# Altium schematic sheet jlin_transceiver_prototype.SchDoc: Prototype Transceiver Board
size B; Engineer: Jonathan Lin; Revision: 1; SheetNumber: 1; SheetTotal: 3
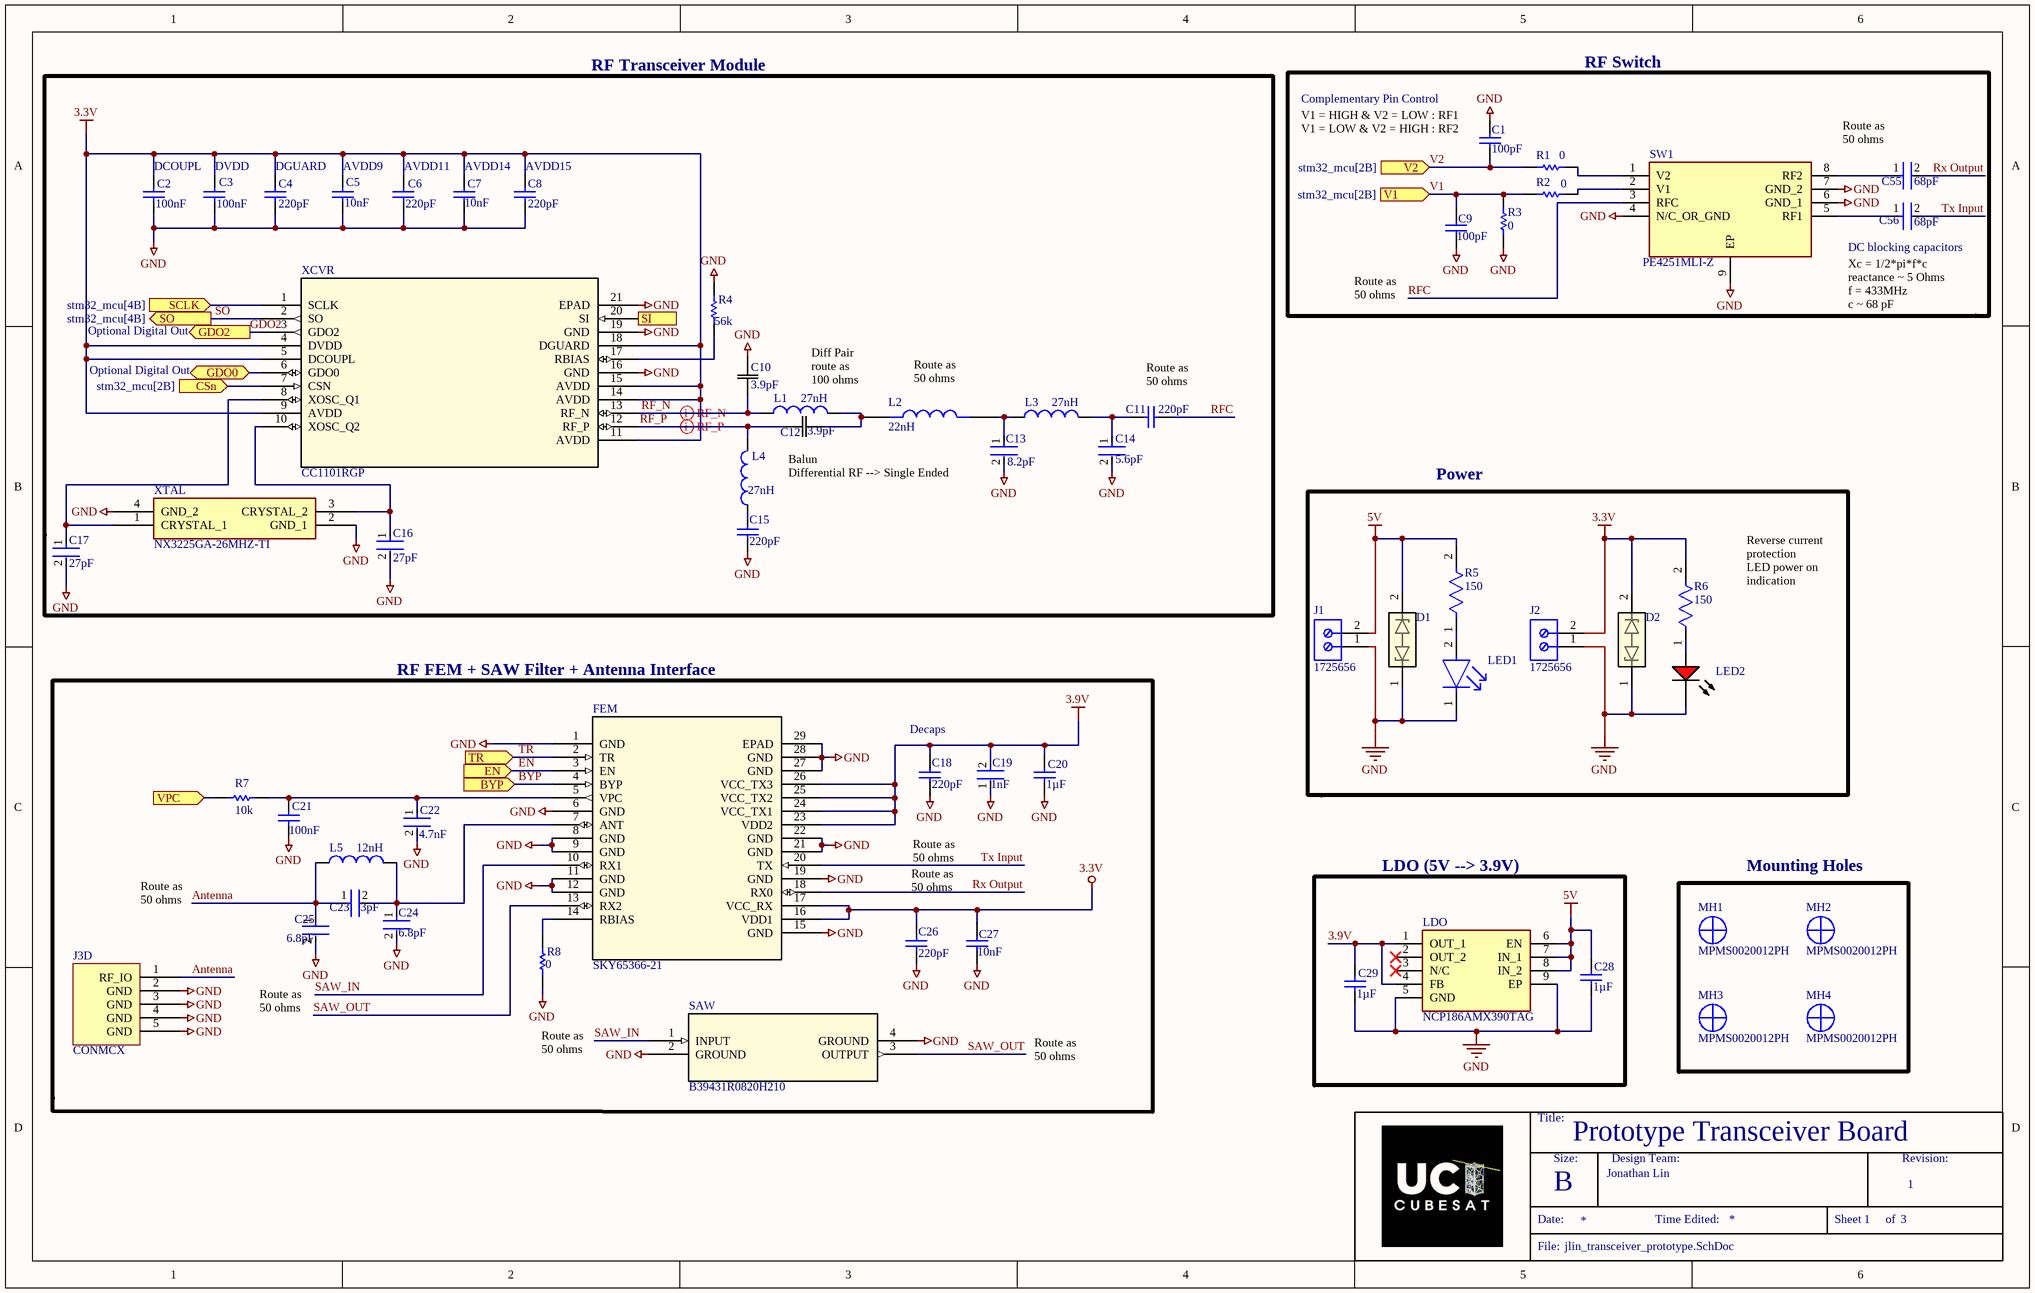
[diagram p0: jlin_transceiver_prototype.SchDoc]

## Parts
C1  value 100pF  [CAPC2013X70X45LL10T25]  (hidden comment: GRM2165C1H101JA01D)
C2  value 100nF  [CAPC2013X135X45ML10T25]  (hidden comment: GRM21BR72A104KAC4L)
C3  value 100nF  [CAPC2013X135X45ML10T25]  (hidden comment: GRM21BR72A104KAC4L)
C4  value 220pF  [CAPC2013X70X45LL10T25]  (hidden comment: GRM2165C1H221JA01D)
C5  value 10nF  [CAPC2013X135X45ML10T25]  (hidden comment: GRM21BR72A103KA01K)
C6  value 220pF  [CAPC2013X70X45LL10T25]  (hidden comment: GRM2165C1H221JA01D)
C7  value 10nF  [CAPC2013X135X45ML10T25]  (hidden comment: GRM21BR72A103KA01K)
C8  value 220pF  [CAPC2013X70X45LL10T25]  (hidden comment: GRM2165C1H221JA01D)
C9  value 100pF  [CAPC2013X70X45LL10T25]  (hidden comment: GRM2165C1H101JA01D)
C10  value 3.9pF  [CAP_CC0805_YAG]  (hidden comment: CC0805CRNPO9BN3R9)
C11  value 220pF  [CAPC2013X70X45LL10T25]  (hidden comment: GRM2165C1H221JA01D)
C12  value 3.9pF  [CAP_CC0805_YAG]  (hidden comment: CC0805CRNPO9BN3R9)
C13  value 8.2pF  [FP-0805-L_2_01_0_2-W_1_25-MFG]  (hidden comment: KGM21BCG2A8R2DT)
C14  value 5.6pF  [FP-C0805C-DN-IPC_A]  (hidden comment: C0805C569C5GACTU)
C15  value 220pF  [CAPC2013X70X45LL10T25]  (hidden comment: GRM2165C1H221JA01D)
C16  value 27pF  [FP-GRM21A-0_2-IPC_B]  (hidden comment: GRM21A5C2E270JW01D)
C17  value 27pF  [FP-GRM21A-0_2-IPC_B]  (hidden comment: GRM21A5C2E270JW01D)
C18  value 220pF  [CAPC2013X70X45LL10T25]  (hidden comment: GRM2165C1H221JA01D)
C19  value 1nF  [FP-GRM216-0_1-IPC_B]  (hidden comment: GRM2165C2A102JA01D)
C20  value 1µF  [CAPC2013X135X45LL10T25]  (hidden comment: GRM21BR71C105KA01L)
C21  value 100nF  [CAPC2013X135X45ML10T25]  (hidden comment: GRM21BR72A104KAC4L)
C22  value 4.7nF  [FP-GRM219-0_1-MFG]  (hidden comment: GRM2195C1H472JA01D)
C23  value 3pF  [FP-C0805C-DN-IPC_A]  (hidden comment: C0805C309C5GACTU)
C24  value 6.8pF  [FP-GQM219-0_15-MFG]  (hidden comment: GQM2195C2E6R8BB12D)
C25  value 6.8pF  [FP-GQM219-0_15-MFG]  (hidden comment: GQM2195C2E6R8BB12D)
C26  value 220pF  [CAPC2013X70X45LL10T25]  (hidden comment: GRM2165C1H221JA01D)
C27  value 10nF  [CAPC2013X135X45ML10T25]  (hidden comment: GRM21BR72A103KA01K)
C28  value 1µF  [CAPC2013X135X45LL10T25]  (hidden comment: GRM21BR71C105KA01L)
C29  value 1µF  [CAPC2013X135X45LL10T25]  (hidden comment: GRM21BR71C105KA01L)
C55  value 68pF  [FP-GRM21A-0_2-IPC_B]  (hidden comment: GRM21A5C2E680JW01D)
C56  value 68pF  [FP-GRM21A-0_2-IPC_B]  (hidden comment: GRM21A5C2E680JW01D)
D1  PESD3V3Z1BCSFYL  [SOD962-2_DSN0603-2_NEX]  (value not drawn)
D2  PESD3V3Z1BCSFYL  [SOD962-2_DSN0603-2_NEX]  (value not drawn)
FEM  SKY65366-21  [SKY65366-21-Footprint-1]
J1  1725656  [PHOE-1725656-2]
J2  1725656  [PHOE-1725656-2]
J3  CONMCX  [CONMCX002-Footprint-1]  (part D of 4)
L1  value 27nH  [WE-MK_0805_L2W1.25H0.85]  (hidden comment: 7447880127)
L2  value 22nH  [INDC2012X105N]  (hidden comment: AIMC-0805-22NJ-T)
L3  value 27nH  [WE-MK_0805_L2W1.25H0.85]  (hidden comment: 7447880127)
L4  value 27nH  [WE-MK_0805_L2W1.25H0.85]  (hidden comment: 7447880127)
L5  value 12nH  [AIMC-0805_ABR]  (hidden comment: AIMC-0805-12NJ-T)
LDO  NCP186AMX390TAG  [NCP186AMX330TAG]
LED1  LTST-C170KFKT  [FP-LTST-C170KFKT-MFG]  (value not drawn)
LED2  LTST-C190KRKT  [LTST-C191KRKT_V]  (value not drawn)
MH1  MPMS0020012PH  [BF-MPMS0020012PH]
MH2  MPMS0020012PH  [BF-MPMS0020012PH]
MH3  MPMS0020012PH  [BF-MPMS0020012PH]
MH4  MPMS0020012PH  [BF-MPMS0020012PH]
R1  value 0  [RESC2013X60X35ML10T20]  (hidden comment: Resistor 0R +/- 5% 0805 125 mW)
R2  value 0  [RESC2013X60X35ML10T20]  (hidden comment: Resistor 0R +/- 5% 0805 125 mW)
R3  value 0  [RESC2013X60X35ML10T20]  (hidden comment: Resistor 0R +/- 5% 0805 125 mW)
R4  value 56k  [RESC2013X70X40NL20T20]  (hidden comment: ERJ-6GEYJ563V)
R5  value 150  [FP-CRCW1210-e3-IPC_C]  (hidden comment: CRCW1210150RJNEA)
R6  value 150  [FP-CRCW1210-e3-IPC_C]  (hidden comment: CRCW1210150RJNEA)
R7  value 10k  [RESC2013X60X35LL10T20]  (hidden comment: RC0805FR-0710KL)
R8  value 0  [RESC2013X60X35ML10T20]  (hidden comment: Resistor 0R +/- 5% 0805 125 mW)
SAW  B39431R0820H210  [B39431R0820H210_QUA]
SW1  PE4251MLI-Z  [SOP65P490X106-9N]
XCVR  CC1101RGP  [CC1101RGP-Footprint-1]
XTAL  NX3225GA-26MHZ-TI  [NX3225GA_NDK]

## Blocks framed on the sheet
RF Transceiver Module: C2-C8 C10-C17 L1-L4 R4 XCVR XTAL
RF Switch: C1 C9 C55 C56 R1-R3 SW1
Power: D1 D2 J1 J2 LED1 LED2 R5 R6
RF FEM + SAW Filter + Antenna Interface: C18-C27 FEM J3 L5 R7 R8 SAW
LDO (5V --> 3.9V): C28 C29 LDO
Mounting Holes: MH1-MH4

## Ports
BYP (in, see stm32_mcu[6A]), CSn (in, see stm32_mcu[2B]), EN (in, see stm32_mcu[6A]), GDO0 (bidir, see stm32_mcu[2B]), GDO2 (out, see stm32_mcu[2B]), SCLK (in, see stm32_mcu[4B]), SI (in, see stm32_mcu[4B]), SO (out, see stm32_mcu[4B]), TR (in, see stm32_mcu[6A]), V1 (in, see stm32_mcu[2B]), V2 (in, see stm32_mcu[2B]), VPC (in, see stm32_mcu[6A])

## Nets
3.3V: C2.2 C3.2 C4.2 C5.2 C6.2 C7.2 C8.2 C26.2 C27.2 D2.2 FEM.16(VDD1) FEM.17(VCC_RX) J2.2 R6.2 XCVR.4(DVDD) XCVR.5(DCOUPL) XCVR.9(AVDD) XCVR.11(AVDD) XCVR.14(AVDD) XCVR.15(AVDD) XCVR.18(DGUARD)
3.9V: C18.2 C19.2 C20.2 C29.2 FEM.23(VDD2) FEM.24(VCC_TX1) FEM.25(VCC_TX2) FEM.26(VCC_TX3) LDO.1(OUT_1) LDO.4(FB)
5V: C28.2 D1.2 J1.2 LDO.6(EN) LDO.7(IN_1) LDO.8(IN_2) R5.2
GND: C1.2 C2.1 C3.1 C4.1 C5.1 C6.1 C7.1 C8.1 C9.1 C10.2 C13.2 C14.2 C15.1 C16.2 C17.2 C18.1 C19.1 C20.1 C21.1 C22.2 C24.2 C25.2 C26.1 C27.1 C28.1 C29.1 D1.1 D2.1 FEM.1(GND) FEM.6(GND) FEM.8(GND) FEM.9(GND) FEM.11(GND) FEM.12(GND) FEM.15(GND) FEM.19(GND) FEM.21(GND) FEM.22(GND) FEM.27(GND) FEM.28(GND) FEM.29(EPAD) J1.1 J2.1 J3.2(GND) J3.3(GND) J3.4(GND) J3.5(GND) LDO.5(GND) LDO.9(EP) LED1.1(C) LED2.2(K) R3.1 R4.2 R8.1 SAW.2(GROUND) SAW.4(GROUND) SW1.4(N/C_OR_GND) SW1.6(GND_1) SW1.7(GND_2) SW1.9(EP) XCVR.16(GND) XCVR.19(GND) XCVR.21(EPAD) XTAL.2(GND_1) XTAL.4(GND_2)
Antenna: C23.1 C25.1 J3.1(RF_IO) L5.1
BYP: FEM.4(BYP) ; port BYP
CSn: XCVR.7(CSN) ; port CSn
EN: FEM.3(EN) ; port EN
GDO0: XCVR.6(GDO0) ; port GDO0
GDO2: XCVR.3(GDO2) ; port GDO2
RF_N: C10.1 L1.1 XCVR.13(RF_N)
RF_P: C12.1 L4.2 XCVR.12(RF_P)
RFC: C11.2 SW1.3(RFC)
Rx Output: C55.2 FEM.18(RX0)
SAW_IN: FEM.10(RX1) SAW.1(INPUT)
SAW_OUT: FEM.13(RX2) SAW.3(OUTPUT)
SCLK: XCVR.1(SCLK) ; port SCLK
SI: XCVR.20(SI) ; port SI
SO: XCVR.2(SO) ; port SO
TR: FEM.2(TR) ; port TR
Tx Input: C56.2 FEM.20(TX)
V1: C9.2 R2.1 R3.2 ; port V1
V2: C1.1 R1.1 ; port V2
VPC: R7.1 ; port VPC
NetC11_1: C11.1 C14.1 L3.2
NetC12_2: C12.2 L1.2 L2.1
NetC13_1: C13.1 L2.2 L3.1
NetC15_2: C15.2 L4.1
NetC16_1: C16.1 XCVR.10(XOSC_Q2) XTAL.3(CRYSTAL_2)
NetC17_1: C17.1 XCVR.8(XOSC_Q1) XTAL.1(CRYSTAL_1)
NetC21_2: C21.2 C22.1 FEM.5(VPC) R7.2
NetC23_2: C23.2 C24.1 FEM.7(ANT) L5.2
NetC55_1: C55.1 SW1.8(RF2)
NetC56_1: C56.1 SW1.5(RF1)
NetFEM_14: FEM.14(RBIAS) R8.2
NetLED1_2: LED1.2(A) R5.1
NetLED2_1: LED2.1(A) R6.1
NetR1_2: R1.2 SW1.1(V2)
NetR2_2: R2.2 SW1.2(V1)
NetR4_1: R4.1 XCVR.17(RBIAS)

Not connected (* = marked no-connect by the designer): LDO 2(OUT_2)* 3(N/C)*; MH1 1; MH2 1; MH3 1; MH4 1

## Layout directives
differential pair: RF_N, RF_P

## Notes on the sheet
- (near C1) Complementary Pin Control
- (near C1) V1 = HIGH & V2 = LOW : RF1
  V1 = LOW & V2 = HIGH : RF2
- Route as
  50 ohms
- (near C2) DCOUPL
- (near C3) DVDD
- (near C4) DGUARD
- (near C5) AVDD9
- (near C6) AVDD11
- (near C7) AVDD14
- (near C8) AVDD15
- DC blocking capacitors
- Optional Digital Out
- Xc = 1/2*pi*f*c
  reactance ~ 5 Ohms
  f = 433MHz
  c ~ 68 pF
- Diff Pair
  route as
  100 ohms
- (near L2) Route as
  50 ohms
- (near C11) Route as
  50 ohms
- Balun
  Differential RF --> Single Ended
- Reverse current protection
  LED power on indication
- (near C18) Decaps
- (near C25) Route as
  50 ohms
- (near R8) Route as
  50 ohms
- Title:
- Size:
- Design Team:
- Revision:
- Date:
- B
- Time Edited:
- Sheet
- of
- File:

## Library data of the parts
C1 C9 = CMP-001-00139-1: Ceramic Capacitor, Multilayer, Ceramic, 50V, 5% +Tol, 5% -Tol, C0G, -/+30ppm/Cel TC, 0.0001uF, Surface Mount, 0805; Multilayer: Yes; Max Operating Temperature: 125°C; Height: 0.6mm; Packaging: Tape and Reel; Temperature Characteristics Code: C0G; Reach SVHC Compliant: Yes; Tolerance (fill in as +-): 5%; Width: 1.25mm; Terminal Finish: Nickel; Tolerance  (fill in as +-): 5%; Package Shape: Rectangular; Termination: Wraparound; Mounting Technology: Surface Mount; Length: 2mm; Package Style: SMTMeter; Dielectric Material: Ceramic; Min Operating Temperature: -55°C; Case/Package: 0805; JESD-609 Code: e3; Capacitor Type: Ceramic; RoHS Compliant: Yes; Rated DC Voltage (URdc): 50V; Pins: 2
C2 C3 C21 = CMP-001-00124-1: Ceramic Capacitor, Multilayer, Ceramic, 100V, 10% +Tol, 10% -Tol, X7R, 15% TC, 0.1uF, Surface Mount, 0805; Multilayer: Yes; Capacitor Type: Ceramic; Width: 1.25mm; Tolerance (fill in as +-): 10%; Max Operating Temperature: 125°C; Package Style: SMTMeter; Termination: Wraparound; Packaging: Tape and Reel; Rated DC Voltage (URdc): 100V; Length: 2mm; Terminal Finish: Nickel; Min Operating Temperature: -55°C; Reach SVHC Compliant: Yes; JESD-609 Code: e3; RoHS Compliant: Yes; Tolerance  (fill in as +-): 10%; Temperature Characteristics Code: X7R; Pins: 2; Dielectric Material: Ceramic; Case/Package: 0805; Package Shape: Rectangular; Mounting Technology: Surface Mount; Height: 1.25mm
C4 C6 C8 C11 C15 C18 C26 = CMP-001-00130-1: Ceramic Capacitor, Multilayer, Ceramic, 50V, 5% +Tol, 5% -Tol, C0G, -/+30ppm/Cel TC, 0.00022uF, Surface Mount, 0805; Multilayer: Yes; Reach SVHC Compliant: Yes; Capacitor Type: Ceramic; Pins: 2; Height: 0.6mm; Length: 2mm; Tolerance (fill in as +-): 5%; Min Operating Temperature: -55°C; Package Shape: Rectangular; Case/Package: 0805; Package Style: SMTMeter; Width: 1.25mm; JESD-609 Code: e3; Tolerance  (fill in as +-): 5%; Packaging: Tape and Reel; Termination: Wraparound; Mounting Technology: Surface Mount; Temperature Characteristics Code: C0G; Max Operating Temperature: 125°C; Dielectric Material: Ceramic; Rated DC Voltage (URdc): 50V; Terminal Finish: Nickel; RoHS Compliant: Yes
  C4 C6 C8: ComponentLink1Description: New link; ComponentLink1URL: *
C5 C7 C27 = CMP-001-00132-1: Ceramic Capacitor, Multilayer, Ceramic, 100V, 10% +Tol, 10% -Tol, X7R, 15% TC, 0.01uF, Surface Mount, 0805; Multilayer: Yes; Case/Package: 0805; Tolerance  (fill in as +-): 10%; JESD-609 Code: e3; Width: 1.25mm; Termination: Wraparound; Pins: 2; Tolerance (fill in as +-): 10%; Dielectric Material: Ceramic; RoHS Compliant: Yes; Capacitor Type: Ceramic; Packaging: Tape and Reel; Rated DC Voltage (URdc): 100V; Length: 2mm; Temperature Characteristics Code: X7R; Terminal Finish: Nickel; Min Operating Temperature: -55°C; Package Style: SMTMeter; Max Operating Temperature: 125°C; Reach SVHC Compliant: Yes; Height: 1.25mm; Mounting Technology: Surface Mount; Package Shape: Rectangular
  C5 C7: ComponentLink1Description: New link; ComponentLink1URL: *
C10 C12 = CMP-001-00101-5: 3.9 pF ±0.25pF 50V Ceramic Capacitor C0G, NP0 0805 (2012 Metric); Mfr_Name: Yageo; RoHS Compliant: Yes; Component Type: Standard; Max Operating Temperature: 125°C; Source: CC0805CRNPO9BN3R9.SchLib; Min Operating Temperature: -55°C; Pins: 2; Capacitor Type: Ceramic; Design Item ID: CC0805CRNPO9BN3R9; Case/Package: 0805; Mounting Technology: Surface Mount
C13 = CMP-001-00135-2: Cap Cer 8.2PF 100V C0G/NP0 0805; Temperature Characteristics Code: C0G; Tolerance (fill in as +-): 6.0976%; Dielectric Material: Ceramic; Multilayer: Yes; Case/Package: 0805; Reach SVHC Compliant: Yes; RoHS Compliant: Yes; JESD-609 Code: e3; Width: 1.25mm; Min Operating Temperature: -55°C; Terminal Finish: Nickel; Mounting Technology: Surface Mount; Rated DC Voltage (URdc): 100V; Termination: Wraparound; Height: 0.94mm; Package Style: SMTMeter; Length: 2.01mm; Pins: 2; Package Shape: Rectangular; Packaging: Tape and Reel; Tolerance  (fill in as +-): 6.0976%; Capacitor Type: Ceramic; Max Operating Temperature: 125°C
C14 = CMP-001-00134-1: Ceramic Capacitor, Multilayer, Ceramic, 50V, 4.46% +Tol, 4.46% -Tol, C0G, 30ppm/Cel TC, 0.0000056uF, Surface Mount, 0805; Tolerance (fill in as +-): 4.4643%; Multilayer: Yes; Capacitor Type: Ceramic; Temperature Characteristics Code: C0G; Packaging: Tape and Reel; Length: 2mm; JESD-609 Code: e3; Dielectric Material: Ceramic; Terminal Finish: Nickel; Tolerance  (fill in as +-): 4.4643%; Rated DC Voltage (URdc): 50V; Pins: 2; Mounting Technology: Surface Mount; Case/Package: 0805; Reach SVHC Compliant: Yes; Package Shape: Rectangular; RoHS Compliant: Yes; Max Operating Temperature: 125°C; Width: 1.25mm; Package Style: SMTMeter; Min Operating Temperature: -55°C; Termination: Wraparound; Height: 0.78mm
C16 C17 = CMP-001-00133-1: Ceramic Capacitor, Multilayer, Ceramic, 250V, 5% +Tol, 5% -Tol, C0G, 30ppm/Cel TC, 0.000027uF, Surface Mount, 0805; Multilayer: Yes; Max Operating Temperature: 125°C; Width: 1.25mm; Mounting Technology: Surface Mount; Length: 2mm; Package Style: SMTMeter; RoHS Compliant: Yes; Tolerance  (fill in as +-): 5%; Termination: Wraparound; Dielectric Material: Ceramic; Packaging: Tape and Reel; Reach SVHC Compliant: Yes; Tolerance (fill in as +-): 5%; Temperature Characteristics Code: C0G; Capacitor Type: Ceramic; Case/Package: 0805; Height: 1mm; Pins: 2; Min Operating Temperature: -55°C; JESD-609 Code: e3; Terminal Finish: Nickel; Rated DC Voltage (URdc): 250V; Package Shape: Rectangular
C19 = CMP-001-00136-1: Ceramic Capacitor, Multilayer, Ceramic, 100V, 5% +Tol, 5% -Tol, C0G, 30ppm/Cel TC, 0.001uF, Surface Mount, 0805; Multilayer: Yes; Package Style: SMTMeter; Capacitor Type: Ceramic; Tolerance (fill in as +-): 5%; Termination: Wraparound; Min Operating Temperature: -55°C; Package Shape: Rectangular; JESD-609 Code: e3; Max Operating Temperature: 125°C; Width: 1.25mm; Packaging: Tape and Reel; Dielectric Material: Ceramic; Mounting Technology: Surface Mount; Terminal Finish: Nickel; Rated DC Voltage (URdc): 100V; Length: 2mm; Pins: 2; Reach SVHC Compliant: Yes; Case/Package: 0805; RoHS Compliant: Yes; Tolerance  (fill in as +-): 5%; Height: 0.6mm; Temperature Characteristics Code: C0G
C20 C28 C29 = CMP-001-00129-1: Ceramic Capacitor, Multilayer, Ceramic, 16V, 10% +Tol, 10% -Tol, X7R, 15% TC, 1uF, Surface Mount, 0805; Multilayer: Yes; Length: 2mm; Terminal Finish: Nickel; RoHS Compliant: Yes; Packaging: Tape and Reel; Termination: Wraparound; Reach SVHC Compliant: Yes; Rated DC Voltage (URdc): 16V; Max Operating Temperature: 125°C; Dielectric Material: Ceramic; Tolerance (fill in as +-): 10%; Min Operating Temperature: -55°C; Package Style: SMTMeter; Case/Package: 0805; Height: 1.25mm; Temperature Characteristics Code: X7R; Capacitor Type: Ceramic; Mounting Technology: Surface Mount; Package Shape: Rectangular; Tolerance  (fill in as +-): 10%; JESD-609 Code: e3; Width: 1.25mm; Pins: 2
C22 = CMP-001-00138-1: Ceramic Capacitor, Multilayer, Ceramic, 50V, 5% +Tol, 5% -Tol, C0G, 30ppm/Cel TC, 0.0047uF, Surface Mount, 0805; Multilayer: Yes; Min Operating Temperature: -55°C; Mounting Technology: Surface Mount; Height: 0.85mm; Width: 1.25mm; Length: 2mm; RoHS Compliant: Yes; Termination: Wraparound; Pins: 2; Max Operating Temperature: 125°C; Tolerance  (fill in as +-): 5%; Package Style: SMTMeter; Package Shape: Rectangular; Reach SVHC Compliant: Yes; Capacitor Type: Ceramic; Tolerance (fill in as +-): 5%; Terminal Finish: Nickel; Temperature Characteristics Code: C0G; JESD-609 Code: e3; Case/Package: 0805; Dielectric Material: Ceramic; Rated DC Voltage (URdc): 50V; Packaging: Tape and Reel
C23 = CMP-001-00142-2: Ceramic Capacitor, Multilayer, Ceramic, 50V, 8.33% +Tol, 8.33% -Tol, C0G, 30ppm/Cel TC, 0.000003uF, Surface Mount, 0805; Multilayer: Yes; Tolerance (fill in as +-): 8.3333%; Max Operating Temperature: 125°C; Reach SVHC Compliant: Yes; Rated DC Voltage (URdc): 50V; RoHS Compliant: Yes; Package Style: SMTMeter; Pins: 2; Dielectric Material: Ceramic; Height: 0.78mm; Min Operating Temperature: -55°C; Termination: Wraparound; Width: 1.25mm; Packaging: Tape and Reel; Length: 2mm; Capacitor Type: Ceramic; Terminal Finish: Nickel; Temperature Characteristics Code: C0G; Case/Package: 0805; Package Shape: Rectangular; Tolerance  (fill in as +-): 8.3333%; JESD-609 Code: e3; Mounting Technology: Surface Mount
C24 C25 = CMP-001-00143-1: Ceramic Capacitor, Multilayer, Ceramic, 250V, 1.47% +Tol, 1.47% -Tol, C0G, -/+30ppm/Cel TC, 0.0000068uF, Surface Mount, 0805; Multilayer: Yes; RoHS Compliant: Yes; Temperature Characteristics Code: C0G; Case/Package: 0805; Capacitor Type: Ceramic; Max Operating Temperature: 125°C; Dielectric Material: Ceramic; Packaging: Tape and Reel; Terminal Finish: Nickel; Tolerance  (fill in as +-): 1.47%; Termination: Wraparound; JESD-609 Code: e3; Package Shape: Rectangular; Reach SVHC Compliant: Yes; Mounting Technology: Surface Mount; Min Operating Temperature: -55°C; Rated DC Voltage (URdc): 250V; Pins: 2; Tolerance (fill in as +-): 1.47%
C55 C56 = CMP-001-00140-1: Ceramic Capacitor, Multilayer, Ceramic, 250V, 5% +Tol, 5% -Tol, C0G, 30ppm/Cel TC, 0.000068uF, Surface Mount, 0805; Multilayer: Yes; Package Shape: Rectangular; Temperature Characteristics Code: C0G; Package Style: SMTMeter; Length: 2mm; Min Operating Temperature: -55°C; Width: 1.25mm; Tolerance  (fill in as +-): 5%; Case/Package: 0805; Dielectric Material: Ceramic; Packaging: Tape and Reel; Termination: Wraparound; RoHS Compliant: Yes; Mounting Technology: Surface Mount; Tolerance (fill in as +-): 5%; Height: 1mm; Capacitor Type: Ceramic; Reach SVHC Compliant: Yes; Pins: 2; JESD-609 Code: e3; Max Operating Temperature: 125°C; Rated DC Voltage (URdc): 250V; Terminal Finish: Nickel
D1 D2 = CMP-004-00036-2: PESD3V3Zxx: 6.8 V 15 A 0.45 pF Bidirectional ESD Protection Diode - DSN0603-2
FEM = CMP-00025-00009-1: RF and Baseband Circuit; RoHS Compliant: Yes
J1 J2 = CMP-2000-05299-1: Male Header, Pitch 2.54 mm, 1 x 2 Position, Height 9 mm, Tail Length 3.5 mm; Manufacturer: Phoenix Contact; Number of contacts: 2; Content: 250pc(s); Pitch: 2.54mm; Industrial packaging: Yes; System: Connector; Colour: Green; Manufacturer part No.: 1725656; Type: MPT0,5/2-2,54; Datasheet URL: http://datasheet.octopart.com/1725656-Phoenix-Contact-datasheet-5302866.pdf; Manufacturer URL: http://www.phoenixcontact.com/; Datasheet Version: Apr-08
J3 = CMP-00025-00005-4: MCX Connector Right Angle Jack (Female), PCB Through-Hole Mount, Gold
L1 L3 L4 = CMP-006-00032-1: Multilayer Inductor, 27Nh, 0.3A, 0805 Rohs Compliant: Yes
L2 = CMP-006-00036-2: General Purpose Inductor, 0.022uH, 5%, 1 Element, Ceramic-Core, SMD, 0805; Case/Size Code: 0805; Shielding: Unshielded; Test Frequency: 15MHz; Quality Factor-Min (at L-nom): 100; MF: Abracon; DC Resistance (DCR): 500mR; Inductor Application: RF INDUCTOR; Self Resonant Frequency: 1.4GHz; Shape/Size Description: RECTANGULAR PACKAGE; Max Current Rating: 300mA; Channels: 1; Reach SVHC Compliant: Yes; Termination: Wraparound; Manufacturer Series: AIMC-0805; Design Item ID: AIMC-0805-22NJ-T; Source: AIMC-0805-22NJ-T.SchLib; Pins: 2; Check_prices: https://www.snapeda.com/parts/AIMC-0805-22NJ-T/Abracon/view-part/?ref=eda; Min Operating Temperature: -55°C; Case/Package: 0805 Abracon; Surface Mount: Yes; Component Type: Standard; Inductance-Nom (L): 0.022uH; Inductor Type: GENERAL PURPOSE INDUCTOR; Max Operating Temperature: 125°C; Core Material: Ceramic; RoHS Compliant: Yes; MP: AIMC-0805-22NJ-T; SnapEDA_Link: https://www.snapeda.com/parts/AIMC-0805-22NJ-T/Abracon/view-part/?ref=snap; Tolerance: 5%; Terminal Placement: Dual Ended
L5 = CMP-006-00034-1: General Purpose Inductor, 0.012uH, 5%, 1 Element, Ceramic-Core, SMD, 0805; DC Resistance (DCR): 350mR; Test Frequency: 15MHz; Channels: 1; Shielding: Unshielded; Self Resonant Frequency: 1.9GHz; Quality Factor-Min (at L-nom): 100; Inductor Application: RF INDUCTOR; Shape/Size Description: RECTANGULAR PACKAGE; Case/Size Code: 0805; Max Current Rating: 300mA; Inductance-Nom (L): 0.012uH; Termination: Wraparound; Terminal Placement: Dual Ended; Core Material: Ceramic; Max Operating Temperature: 125°C; Pins: 2; Reach SVHC Compliant: Yes; Min Operating Temperature: -55°C; RoHS Compliant: Yes; Manufacturer Series: AIMC-0805; Surface Mount: Yes; Tolerance: 5%; Inductor Type: GENERAL PURPOSE INDUCTOR
LDO = CMP-031-00016-2: Fixed Positive LDO Regulator, 3.9V, 0.13V Dropout, CMOS, PDSO8; Manufacturer_Name: onsemi; Max Supply Voltage: 5.5V; Regulator Type: FIXED POSITIVE SINGLE OUTPUT LDO REGULATOR; Min Input Voltage: 4.4V; Output Current1-Max: 1A; Output Voltage1-Min: 3.822V; Package Body Material: Plastic; Channels: 1; Dropout Voltage1-Max: 130mV; Output Voltage1-Max: 3.939V; Source: SamacSys.SchLib; Design Item ID: NCP186AMX390TAG; Mouser Price/Stock: https://www.mouser.co.uk/ProductDetail/onsemi/NCP186AMX390TAG?qs=tCMd4XlZ%2FiBm0g5PCqviEQ%3D%3D; Mouser Part Number: 863-NCP186AMX390TAG; Arrow Price/Stock: https://www.arrow.com/en/products/ncp186amx390tag/on-semiconductor?region=nac; Datasheet Link: https://www.onsemi.com/pub/Collateral/NCP186-D.PDF; Manufacturer_Part_Number: NCP186AMX390TAG; Arrow Part Number: NCP186AMX390TAG; JESD-609 Code: e4; Terminal Pitch: 0.4mm; Operating Temperature, TJ-Max: 125°C; Output Voltage1-Nom: 3.9V; Width: 1.2mm; Terminal Finish: Nickel; Case/Package: HVSON; JESD-30 Code: R-PDSO-N8; Terminal Form: No Lead; Technology: CMOS; Reach SVHC Compliant: Yes; Terminal Position: DUAL; Operating Temperature, TJ-Min: -40°C; Package Style: SMALL OUTLINE, HEAT SINK/SLUG, VERY THIN PROFILEMeter; RoHS Compliant: Yes; Surface Mount: Yes; Height - Seated (Max): 0.45mm; Package Shape: Rectangular; Length: 1.6mm; Pins: 8; Moisture Sensitivity Level: 1
LED1 = CMP-007-00038-1: Single Color LED, Orange, Water Clear, 1.4mm; Shape: Rectangular; Forward Current: 30mA; Viewing Angle: 130°; Channels: 1; Reverse Voltage-Max: 5V; Forward Voltage: 2.4V; Luminous Intensity-Nom: 60mcd; Overall Height: 1.1mm; Max Operating Temperature: 85°C; RoHS Compliant: Yes; Packaging: Tape and Reel; Reach SVHC Compliant: Yes; Size: 1.4mm; Lens Style: WATER CLEAR; Terminal Finish: Tin; Mounting Technology: Surface Mount; Terminal Pitch: 2.1mm; Color: Orange; Optoelectronic Device Type: SINGLE COLOR LED; Color@wavelength: Orange; Min Operating Temperature: -55°C; JESD-609 Code: e3; Pins: 2
LED2 = CMP-007-00024-2: LED Uni-Color Red, 62.5 mW, 25 mA, -30 to 85 degC, 2-Pin SMD, RoHS, Tape and Reel; Manufacturer: Lite-On; Power: 75mW; Forward Voltage: 2V; Luminous Intensity: 54mcd; Lens Style: Diffused; Viewing Angle: 130degrees; Forward Current: 20mA; Manufacturer URL: http://www.us.liteon.com/; Case/Package: 0603; Datasheet Version: Rev. F, 05/2013; Package Reference: C191KRKT; Datasheet URL: http://optoelectronics.liteon.com/upload/download/DS-22-99-0151/S_110_LTST-C190KRKT.pdf; Package Description: 2-Pin Surface Mount Device, Body 1.6 x 0.8 mm; Nominal Vf: 2V; Packaging: TapeandReel; RoHS Compliant: True; Pins: 2; Illumination Colour: Red; Colour: Red; Mounting Technology: SM; Package Quantity: 3000; Min Operating Temperature: -55°C; Max Operating Temperature: 85°C
MH1 MH2 = CMP-00028-00000-5: Copper Pillar, M2 Screw; Manufacturer: B&F Fastener Supply; Drive Type: Phillips; Screw Head Type: PanHead; Mounting Technology: TH; Datasheet URL: https://datasheet.ciiva.com/1034/metd7985a-1034196.pdf; Thread Size: M2; Case/Package: MPMS0020012PH; Package Reference: MPMS0020012PH; Datasheet Version: 42095; Pins: 1; Package Description: 1-Pin Surface Mount Device, Diameter 3.7 mm; Type: MachineScrew; Manufacturer URL: http://www.bffastenersupply.com/; RoHS Compliant: False
MH3 MH4 = CMP-00028-00000-4: Copper Pillar, M2 Screw; Manufacturer: B&F Fastener Supply; Drive Type: Phillips; Screw Head Type: PanHead; Mounting Technology: TH; Datasheet URL: https://datasheet.ciiva.com/1034/metd7985a-1034196.pdf; Thread Size: M2; Case/Package: MPMS0020012PH; Package Reference: MPMS0020012PH; Datasheet Version: 42095; Pins: 1; Package Description: 1-Pin Surface Mount Device, Diameter 3.7 mm; Type: MachineScrew; Manufacturer URL: http://www.bffastenersupply.com/; RoHS Compliant: False
R1-R3 R8 = CMP-009-00007-5: Chip Resistor, 0 Ohm, 0.125 W, -55 to 155 degC, 0805 (2012 Metric); Power: 125mW; Voltage Rating: 50V; RoHS Compliant: True; Max Operating Temperature: 155°C; Case/Package: 0805; Mounting Technology: SM; Min Operating Temperature: -55°C; Tolerance: 5%; Pins: 2
R4 = CMP-009-00202-1: Fixed Resistor, Metal Glaze/thick Film, 0.125W, 56000ohm, 150V, 5% +/-Tol, 200ppm/Cel, Surface Mount, 0805; Package Height: 0.6mm; Power: 125mW; Temperature Coefficient (ppm/Cel): 200; Package Width: 1.25mm; Reference Standard: AEC-Q200; Package Length: 2mm; Rated Temperature: 70°C; Case/Package: 0805; Terminal Finish: Nickel; Reach SVHC Compliant: Yes; Min Operating Temperature: -55°C; Construction: Rectangular; Resistor Type: FIXED RESISTOR; Termination: Wraparound; JESD-609 Code: e3; Package Shape: Rectangular; Tolerance: 5%; Mounting Technology: Surface Mount; Packaging: Tape and Reel; Working Voltage: 150V; Max Operating Temperature: 155°C; RoHS Compliant: Yes; Technology: METAL GLAZE/THICK FILM; Pins: 2
R5 R6 = CMP-009-00203-1: Fixed Resistor, Metal Glaze/thick Film, 0.5W, 150ohm, 200V, 5% +/-Tol, 200ppm/Cel, Surface Mount, 1210; Reference Standard: AEC-Q200; Package Width: 2.5mm; Package Height: 0.55mm; Temperature Coefficient (ppm/Cel): 200; Power: 500mW; Rated Temperature: 70°C; Additional Feature: RATED AC VOLTAGE (V): 200; Package Length: 3.2mm; RoHS Compliant: Yes; Terminal Finish: Nickel; Reach SVHC Compliant: Yes; Pins: 2; JESD-609 Code: e3; Construction: Chip; Case/Package: 1210; Packaging: Tape and Reel; Working Voltage: 200V; Max Operating Temperature: 155°C; Resistor Type: FIXED RESISTOR; Min Operating Temperature: -55°C; Mounting Technology: Surface Mount; Termination: Wraparound; Technology: METAL GLAZE/THICK FILM; Tolerance: 5%; Package Shape: Rectangular
R7 = CMP-009-00200-1: Fixed Resistor, Metal Glaze/thick Film, 0.125W, 10000ohm, 150V, 1% +/-Tol, 100ppm/Cel, Surface Mount, 0805; Power: 125mW; Package Height: 0.5mm; Temperature Coefficient (ppm/Cel): 100; Package Width: 1.25mm; Package Length: 2mm; Rated Temperature: 70°C; Additional Feature: LASER TRIMMABLE; Mounting Technology: Surface Mount; Case/Package: 0805; Pins: 2; RoHS Compliant: Yes; Min Operating Temperature: -55°C; Max Operating Temperature: 155°C; Tolerance: 1%; JESD-609 Code: e3; Resistor Type: FIXED RESISTOR; Construction: Chip; Package Shape: Rectangular; Packaging: Tape and Reel; Working Voltage: 150V; Termination: Wraparound; Technology: METAL GLAZE/THICK FILM; Terminal Finish: Nickel; Reach SVHC Compliant: Yes
SAW = CMP-00025-00006-2: 433.92MHz SAW Resonator50 Ohm -40¡ãC ~ 125¡ãC Surface Mount
SW1 = CMP-031-00015-2: SPDT, 10MHz Min, 3000MHz Max, 1 Func, 0.9dB Insertion Loss-Max, CMOS; Manufacturer_Name: Peregrine Semiconductor; Channels: 1; 1 dB Compression Point: 30.5dBm; Isolation-Min: 42dB; On Time-Nom: 0.15us; Power Supplies: 3.3/5V; Package Body Material: Plastic; Operating Frequency-Max: 3GHz; Characteristic Impedance: 50R; Package Equivalence Code: TSSOP8,.19; Port Termination: ABSORPTIVE; Manufacturer_Part_Number: PE4251MLI-Z; Datasheet Link: http://www.psemi.com/pdf/datasheets/pe4251ds.pdf; Mouser Part Number: 81-PE4251MLI-Z; Source: SamacSys.SchLib; Height: 1.06mm; Mouser Price/Stock: https://www.mouser.co.uk/ProductDetail/pSemi/PE4251MLI-Z?qs=iw0hurA%2FaD2z5EU4g7%252BX%2Fg%3D%3D; Design Item ID: PE4251MLI-Z; Operating Frequency-Min: 10MHz; Pins: 8; Technology: CMOS; Terminal Finish: Tin; RF/Microwave Device Type: SPDT; Construction: COMPONENT; Max Operating Temperature: 85°C; Insertion Loss-Max: 0.9dB; JESD-609 Code: e3; Min Operating Temperature: -40°C; Mounting Technology: Surface Mount; Reach SVHC Compliant: Yes; RoHS Compliant: Yes
XCVR = CMP-00025-00007-1: RF and Baseband Circuit, PQCC20; Case/Package: HVQCCN; Pins: 20; RoHS Compliant: Yes; Min Operating Temperature: -40°C; Max Operating Temperature: 85°C
XTAL = CMP-003-00033-2: Crystal 26.0000MHZ 10PF SMD